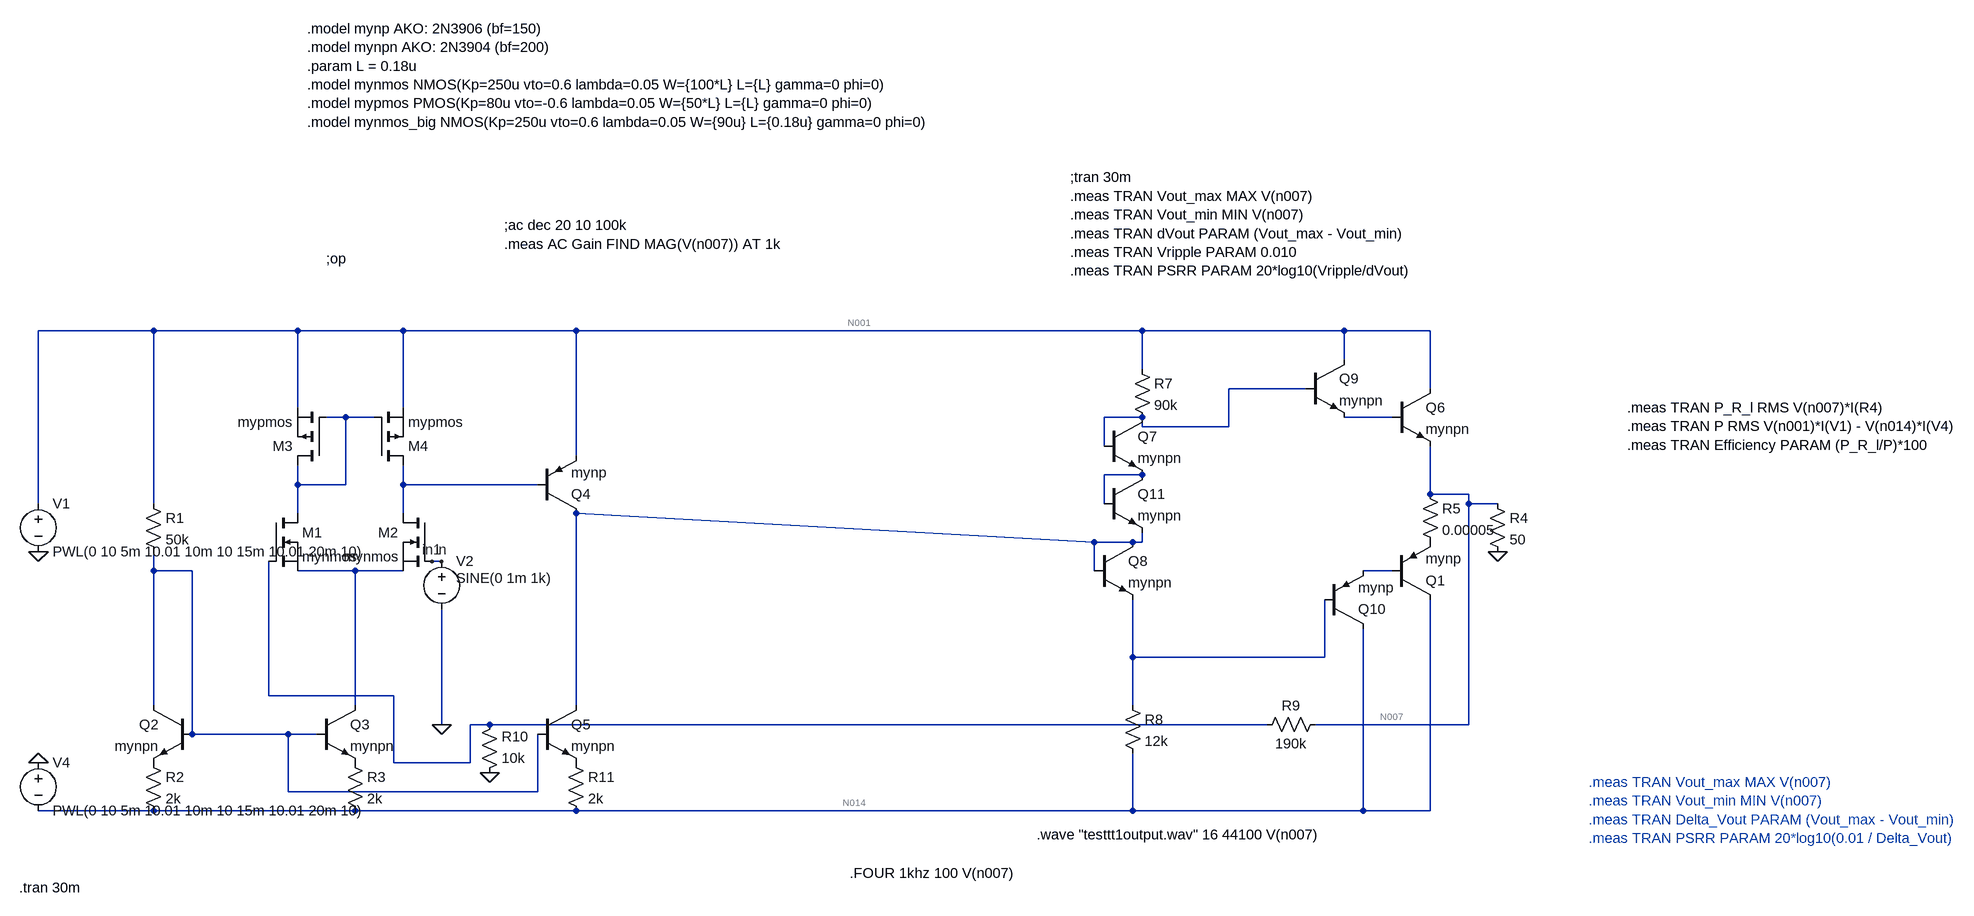
[diagram p0: schematic project.asc]
project.asc, the LTspice schematic file:
Version 4
SHEET 1 3108 1796
WIRE -112 160 -304 160
WIRE 128 160 -112 160
WIRE 304 160 128 160
WIRE 592 160 304 160
WIRE 1536 160 592 160
WIRE 1872 160 1536 160
WIRE 2016 160 1872 160
WIRE 1872 208 1872 160
WIRE 1536 224 1536 160
WIRE 1808 256 1680 256
WIRE 2016 256 2016 160
WIRE 128 288 128 160
WIRE 304 288 304 160
WIRE 208 304 176 304
WIRE 256 304 208 304
WIRE 1536 304 1472 304
WIRE 1952 304 1872 304
WIRE 1536 320 1536 304
WIRE 1680 320 1680 256
WIRE 1680 320 1536 320
WIRE 1472 352 1472 304
WIRE 592 368 592 160
WIRE 1536 400 1472 400
WIRE 128 416 128 384
WIRE 208 416 208 304
WIRE 208 416 128 416
WIRE 304 416 304 384
WIRE 528 416 304 416
WIRE 2016 432 2016 352
WIRE 2080 432 2016 432
WIRE -304 448 -304 160
WIRE -112 448 -112 160
WIRE 1472 448 1472 400
WIRE 2080 448 2080 432
WIRE 2128 448 2080 448
WIRE 128 464 128 416
WIRE 304 464 304 416
WIRE 1456 512 592 464
WIRE 1520 512 1456 512
WIRE 1536 512 1536 496
WIRE 1536 512 1520 512
WIRE 368 544 352 544
WIRE -112 560 -112 528
WIRE -48 560 -112 560
WIRE 224 560 128 560
WIRE 304 560 224 560
WIRE 1456 560 1456 512
WIRE 1952 560 1904 560
WIRE 1520 704 1520 608
WIRE 1840 704 1840 608
WIRE 1840 704 1520 704
WIRE 80 768 80 544
WIRE 288 768 80 768
WIRE -112 784 -112 560
WIRE 224 784 224 560
WIRE 592 784 592 464
WIRE 1520 784 1520 704
WIRE 368 816 368 624
WIRE 448 816 416 816
WIRE 1744 816 448 816
WIRE 2080 816 2080 448
WIRE 2080 816 1824 816
WIRE -48 832 -48 560
WIRE 112 832 -48 832
WIRE 160 832 112 832
WIRE 288 880 288 768
WIRE 416 880 416 816
WIRE 416 880 288 880
WIRE 112 928 112 832
WIRE 528 928 528 832
WIRE 528 928 112 928
WIRE -112 960 -304 960
WIRE 224 960 -112 960
WIRE 592 960 224 960
WIRE 1520 960 1520 864
WIRE 1520 960 592 960
WIRE 1904 960 1904 656
WIRE 1904 960 1520 960
WIRE 2016 960 2016 608
WIRE 2016 960 1904 960
FLAG 368 816 0
FLAG -304 528 0
FLAG -304 880 0
FLAG 368 544 in
FLAG 352 544 in1
FLAG 448 896 0
FLAG 2128 528 0
DATAFLAG 2096 448 ""
SYMBOL nmos 80 464 R0
SYMATTR InstName M1
SYMATTR Value mynmos
SYMBOL nmos 352 464 M0
SYMATTR InstName M2
SYMATTR Value mynmos
SYMBOL res -128 432 R0
SYMATTR InstName R1
SYMATTR Value 50k
SYMBOL voltage -304 432 R0
WINDOW 123 0 0 Left 0
WINDOW 39 0 0 Left 0
SYMATTR InstName V1
SYMATTR Value PWL(0 10 5m 10.01 10m 10 15m 10.01 20m 10)
SYMBOL voltage 368 528 R0
WINDOW 123 24 44 Left 2
WINDOW 39 0 0 Left 0
WINDOW 3 24 44 Left 2
SYMATTR Value SINE(0 1m 1k)
SYMATTR InstName V2
SYMBOL voltage -304 864 R0
WINDOW 123 0 0 Left 0
WINDOW 39 0 0 Left 0
SYMATTR InstName V4
SYMATTR Value PWL(0 10 5m 10.01 10m 10 15m 10.01 20m 10)
SYMBOL npn -48 784 M0
SYMATTR InstName Q2
SYMATTR Value mynpn
SYMBOL npn 160 784 R0
SYMATTR InstName Q3
SYMATTR Value mynpn
SYMBOL res -128 864 R0
SYMATTR InstName R2
SYMATTR Value 2k
SYMBOL res 208 864 R0
SYMATTR InstName R3
SYMATTR Value 2k
SYMBOL pmos 176 384 R180
SYMATTR InstName M3
SYMATTR Value mypmos
SYMBOL pmos 256 384 M180
SYMATTR InstName M4
SYMATTR Value mypmos
SYMBOL npn 528 784 R0
SYMATTR InstName Q5
SYMATTR Value mynpn
SYMBOL res 576 864 R0
SYMATTR InstName R11
SYMATTR Value 2k
SYMBOL pnp 528 464 M180
SYMATTR InstName Q4
SYMATTR Value mynp
SYMBOL res 2000 416 R0
SYMATTR InstName R5
SYMATTR Value 0.00005
SYMBOL pnp 1952 608 M180
SYMATTR InstName Q1
SYMATTR Value mynp
SYMBOL npn 1952 256 R0
SYMATTR InstName Q6
SYMATTR Value mynpn
SYMBOL npn 1472 304 R0
SYMATTR InstName Q7
SYMATTR Value mynpn
SYMBOL npn 1456 512 R0
SYMATTR InstName Q8
SYMATTR Value mynpn
SYMBOL res 1520 208 R0
SYMATTR InstName R7
SYMATTR Value 90k
SYMBOL res 1504 768 R0
SYMATTR InstName R8
SYMATTR Value 12k
SYMBOL res 1840 800 R90
WINDOW 0 0 56 VBottom 2
WINDOW 3 32 56 VTop 2
SYMATTR InstName R9
SYMATTR Value 190k
SYMBOL res 432 912 M180
WINDOW 0 36 76 Left 2
WINDOW 3 36 40 Left 2
SYMATTR InstName R10
SYMATTR Value 10k
SYMBOL npn 1808 208 R0
SYMATTR InstName Q9
SYMATTR Value mynpn
SYMBOL pnp 1840 656 M180
SYMATTR InstName Q10
SYMATTR Value mynp
SYMBOL npn 1472 400 R0
SYMATTR InstName Q11
SYMATTR Value mynpn
SYMBOL res 2112 432 R0
SYMATTR InstName R4
SYMATTR Value 50
TEXT 144 -344 Left 2 !.model mynp AKO: 2N3906 (bf=150)\n.model mynpn AKO: 2N3904 (bf=200)\n.param L = 0.18u\n.model mynmos NMOS(Kp=250u vto=0.6 lambda=0.05 W={100*L} L={L} gamma=0 phi=0)\n.model mypmos PMOS(Kp=80u vto=-0.6 lambda=0.05 W={50*L} L={L} gamma=0 phi=0)\n.model mynmos_big NMOS(Kp=250u vto=0.6 lambda=0.05 W={90u} L={0.18u} gamma=0 phi=0)
TEXT 176 40 Left 2 !;op
TEXT 2392 288 Left 2 !.meas TRAN P_R_l RMS V(n007)*I(R4)\n.meas TRAN P RMS V(n001)*I(V1) - V(n014)*I(V4)\n.meas TRAN Efficiency PARAM (P_R_l/P)*100
TEXT 1048 1064 Left 2 !.FOUR 1khz 100 V(n007)
TEXT 2328 912 Left 2 ;.meas TRAN Vout_max MAX V(n007)\n.meas TRAN Vout_min MIN V(n007)\n.meas TRAN Delta_Vout PARAM (Vout_max - Vout_min)\n.meas TRAN PSRR PARAM 20*log10(0.01 / Delta_Vout)
TEXT 472 -16 Left 2 !;ac dec 20 10 100k\n.meas AC Gain FIND MAG(V(n007)) AT 1k
TEXT 1416 -96 Left 2 !;tran 30m\n.meas TRAN Vout_max MAX V(n007)\n.meas TRAN Vout_min MIN V(n007)\n.meas TRAN dVout PARAM (Vout_max - Vout_min)\n.meas TRAN Vripple PARAM 0.010\n.meas TRAN PSRR PARAM 20*log10(Vripple/dVout)
TEXT 1360 1000 Left 2 !.wave "testtt1output.wav" 16 44100 V(n007)
TEXT -336 1088 Left 2 !.tran 30m

The netlist it stands for:
* project.asc
M1 N003 N013 N010 N010 mynmos
M2 N006 in1 N010 N010 mynmos
R1 N001 N009 50k
V1 N001 0 PWL(0 10 5m 10.01 10m 10 15m 10.01 20m 10)
V2 in1 0 SINE(0 1m 1k)
V4 0 N014 PWL(0 10 5m 10.01 10m 10 15m 10.01 20m 10)
Q2 N009 N009 P001 0 mynpn
Q3 N010 N009 P002 0 mynpn
R2 P001 N014 2k
R3 P002 N014 2k
M3 N003 N003 N001 N001 mypmos
M4 N006 N003 N001 N001 mypmos
Q5 N008 N009 P003 0 mynpn
R11 P003 N014 2k
Q4 N008 N006 N001 0 mynp
R5 N007 P004 0.00005
Q1 N014 N011 P004 0 mynp
Q6 N001 N004 N007 0 mynpn
Q7 N002 N002 N005 0 mynpn
Q8 N008 N008 N012 0 mynpn
R7 N001 N002 90k
R8 N012 N014 12k
R9 N007 N013 190k
R10 0 N013 10k
Q9 N001 N002 N004 0 mynpn
Q10 N014 N012 N011 0 mynp
Q11 N005 N005 N008 0 mynpn
R4 N007 0 50
.model NPN NPN
.model PNP PNP
.lib standard.bjt
.model NMOS NMOS
.model PMOS PMOS
.lib standard.mos
.model mynp AKO: 2N3906 (bf=150)
.model mynpn AKO: 2N3904 (bf=200)
.param L = 0.18u
.model mynmos NMOS(Kp=250u vto=0.6 lambda=0.05 W={100*L} L={L} gamma=0 phi=0)
.model mypmos PMOS(Kp=80u vto=-0.6 lambda=0.05 W={50*L} L={L} gamma=0 phi=0)
.model mynmos_big NMOS(Kp=250u vto=0.6 lambda=0.05 W={90u} L={0.18u} gamma=0 phi=0)
;op
.meas TRAN P_R_l RMS V(n007)*I(R4)
.meas TRAN P RMS V(n001)*I(V1) - V(n014)*I(V4)
.meas TRAN Efficiency PARAM (P_R_l/P)*100
.FOUR 1khz 100 V(n007)
* .meas TRAN Vout_max MAX V(n007)
* .meas TRAN Vout_min MIN V(n007)
* .meas TRAN Delta_Vout PARAM (Vout_max - Vout_min)
* .meas TRAN PSRR PARAM 20*log10(0.01 / Delta_Vout)
;ac dec 20 10 100k
.meas AC Gain FIND MAG(V(n007)) AT 1k
;tran 30m
.meas TRAN Vout_max MAX V(n007)
.meas TRAN Vout_min MIN V(n007)
.meas TRAN dVout PARAM (Vout_max - Vout_min)
.meas TRAN Vripple PARAM 0.010
.meas TRAN PSRR PARAM 20*log10(Vripple/dVout)
.wave "testtt1output.wav" 16 44100 V(n007)
.tran 30m
.backanno
.end